# EAGLE design ApolloVoltReg (EAGLE 7.7.0)
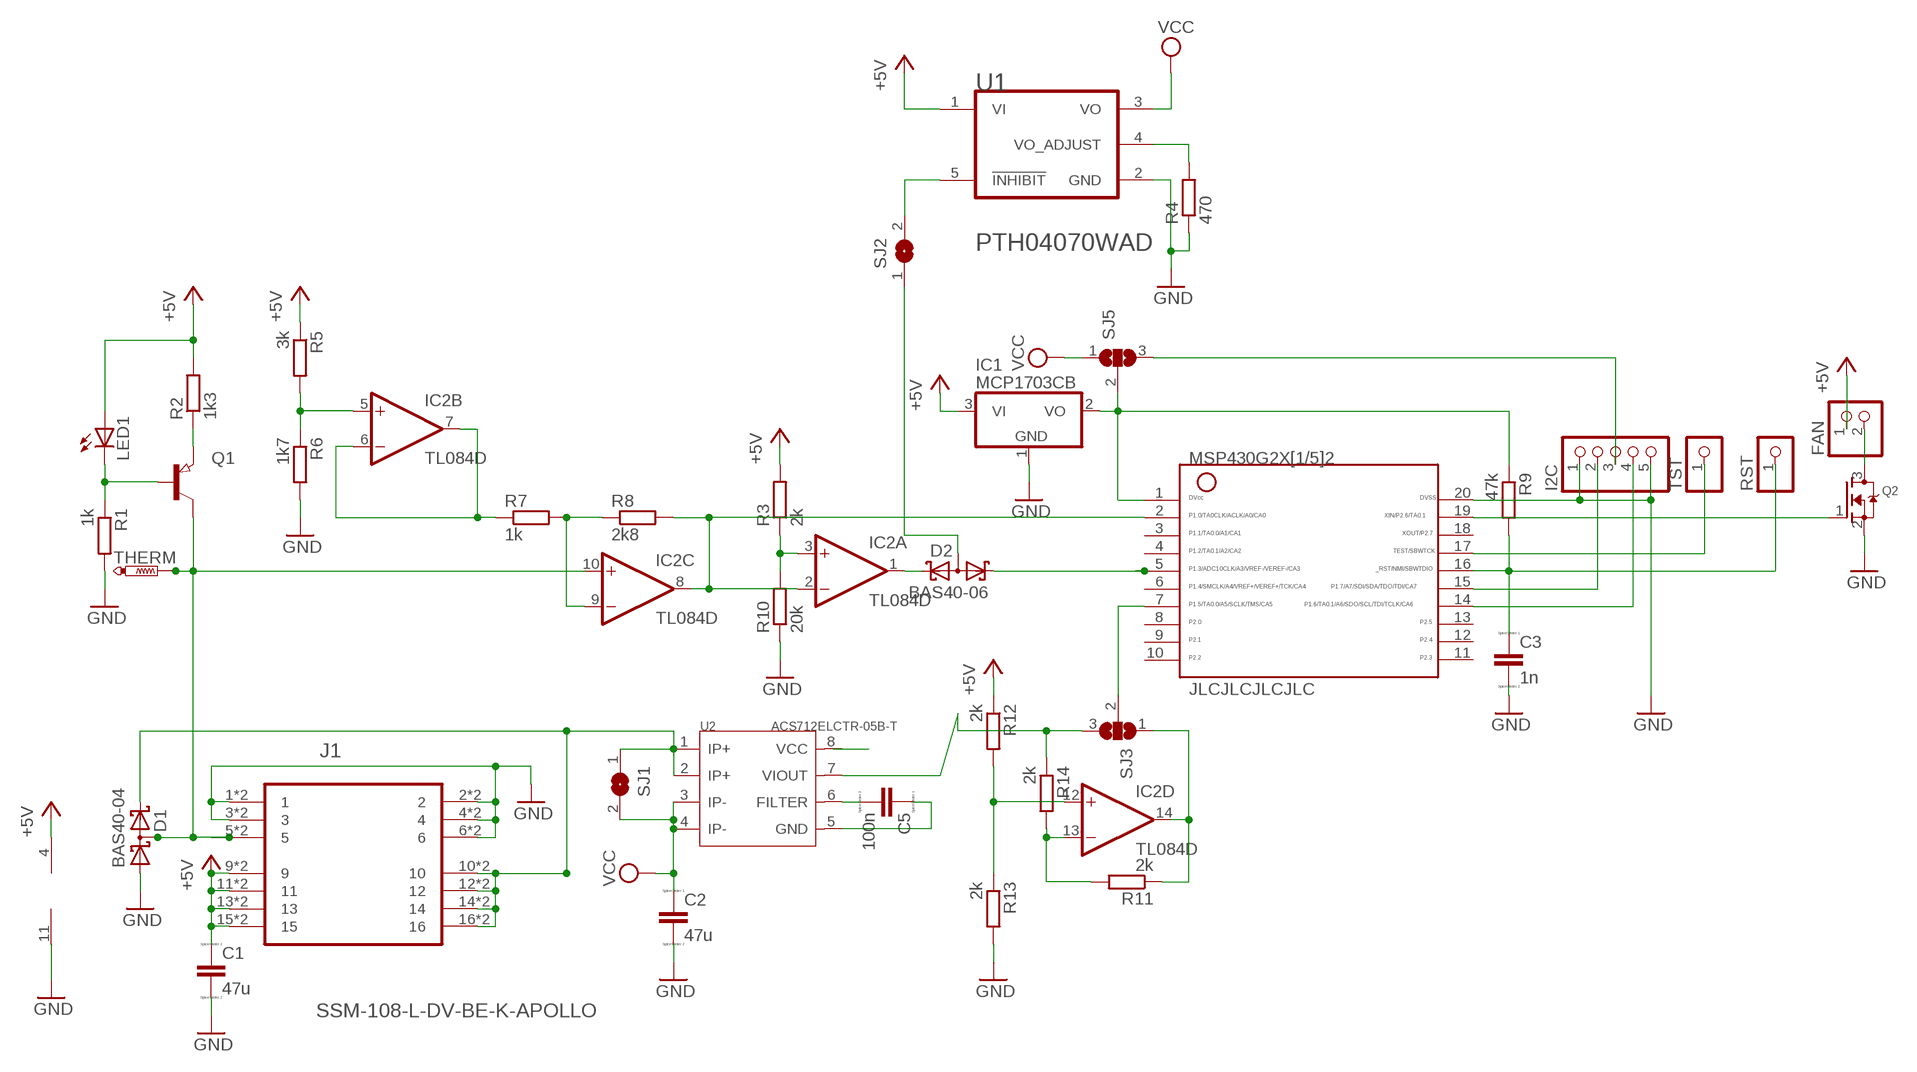
[diagram p0: schematic, sheet 1]

## Parts
C1  47u  CC1210  [C1210]
C2  47u  CC1210  [C1210]
C3  1n  CC0603  [C0603]
C5  100n  CC0603  [C0603]
D1  BAS40-04  [SOT23]
D2  BAS40-06  [SOT23]
FAN  PINHD-1X2  [1X02]
I2C  PINHD-1X5  [1X05]
IC1  MCP1703CB  [SOT23]
IC2  TL084D  [SO14]
J1  SSM-108-L-DV-BE-K-APOLLO  [SAMTEC_SSM-108-L-DV-BE-K-APOLLO]
JLCJLCJLCJLC  G2X[1/5]2---N20  [N20]
LED1  LED3MM  [LED3MM]
Q1  PNP-TRANSISTOR_SOT23  [SOT23]
Q2  MOSFET-NREFLOW  [SOT23]
R1  1k  R-EU_R0805  [R0805]
R2  1k3  R-EU_R0805  [R0805]
R3  2k  R-EU_R0805  [R0805]
R4  470  R-EU_R0805  [R0805]
R5  3k  R-EU_R0805  [R0805]
R6  1k7  R-EU_R0805  [R0805]
R7  1k  R-EU_R0805  [R0805]
R8  2k8  R-EU_R0805  [R0805]
R9  47k  R-EU_R0603  [R0603]
R10  20k  R-EU_R0805  [R0805]
R11  2k  R-EU_R0805  [R0805]
R12  2k  R-EU_R0805  [R0805]
R13  2k  R-EU_R0805  [R0805]
R14  2k  R-EU_R0603  [R0603]
RST  PINHD-1X1CB  [1X01-CLEANBIG]
SJ1  SJW  [SJW]
SJ2  SJ  [SJ]
SJ3  SJ2W  [SJ_2]
SJ5  SJ2W  [SJ_2]
THERM  PTR1B1,27  [B1,27]
TST  PINHD-1X1CB  [1X01-CLEANBIG]
U1  TEXAS_INSTRUMENTS_PTH04070WADTEXAS_INSTRUMENTS_PTH04070WAD_0_0  [TEXAS_INSTRUMENTS_PTH04070WAD_0]
U2  ACS712ELCTR-05B-T  CURRENT-ACS712ELCTR-05B-T(SOIC8-5X4MM)  [SOIC8-1.27-5X4MM]

## Nets
+5V: C1.1 FAN.1 IC1.3(VI) IC2.4(P:V+) J1.9 J1.11 J1.13 J1.15 J1.29 J1.31 J1.33 J1.35 LED1.A R2.2 R3.2 R5.1 R12.1 U1.1(VI) U2.8(VCC)
/INHIBIT: SJ2.2 U1.5(!INHIBIT!)
ACS_OUT: R14.1 SJ3.3 U2.7(VIOUT)
CPU: D1.2(C2) J1.10 J1.12 J1.14 J1.16 J1.30 J1.32 J1.34 J1.36 SJ1.1 U2.1(IP+) U2.2(IP+)
GND: C1.2 C2.2 C3.2 C5.1 D1.1(A1) I2C.1 I2C.5 IC1.1(GND) IC2.11(P:V-) J1.1 J1.2 J1.3 J1.4 J1.6 J1.21 J1.22 J1.23 J1.24 J1.26 JLCJLCJLCJLC.20 Q2.2(S) R1.2 R4.1 R6.2 R10.1 R13.2 U1.2(GND) U2.5(GND)
N$2: LED1.K(C) Q1.1(B) R1.1
N$3: Q1.2(E) R2.1
N$4: IC2.12(D:+IN) R12.2 R13.1
N$5: C5.2 U2.6(FILTER)
N$6: IC2.5(B:+IN) R5.2 R6.1
N$7: IC2.6(B:-IN) IC2.7(B:OUT) R7.1
N$8: IC2.9(C:-IN) R7.2 R8.1
N$9: JLCJLCJLCJLC.19 Q2.1(G)
N$10: JLCJLCJLCJLC.17 TST.1
N$11: IC2.3(A:+IN) R3.1 R10.2
N$12: D2.1(K1) JLCJLCJLCJLC.5
N$13: IC2.13(D:-IN) R11.2 R14.2
N$14: IC2.14(D:OUT) R11.1 SJ3.1
N$15: JLCJLCJLCJLC.7 SJ3.2
N$16: IC1.2(VO) JLCJLCJLCJLC.1 R9.1 SJ5.2
N$17: D2.2(K2) IC2.1(A:OUT)
N$18: D2.3(AA) SJ2.1
N$19: FAN.2 Q2.3(D)
N$21: I2C.3 SJ5.3
RST: C3.1 JLCJLCJLCJLC.16 R9.2 RST.1
SCL: I2C.4 JLCJLCJLCJLC.14
SDA: I2C.2 JLCJLCJLCJLC.15
TEMPSENS: IC2.2(A:-IN) IC2.8(C:OUT) JLCJLCJLCJLC.2 R8.2
THERM1: D1.3(C1A2) IC2.10(C:+IN) J1.5 J1.25 Q1.3(C) THERM.TP
VCC: C2.1 SJ1.2 SJ5.1 U1.3(VO) U2.3(IP-) U2.4(IP-)
VO_ADJ: R4.2 U1.4(VO_ADJUST)
Unconnected: JLCJLCJLCJLC.3 JLCJLCJLCJLC.4 JLCJLCJLCJLC.6 JLCJLCJLCJLC.8 JLCJLCJLCJLC.9 JLCJLCJLCJLC.10 JLCJLCJLCJLC.11 JLCJLCJLCJLC.12 JLCJLCJLCJLC.13 JLCJLCJLCJLC.18

## Library data of the parts
C1-C3 C5 = eagle-ltspice:C: CAPACITOR, European symbol; SPICEMODEL: NONE; SPICEPREFIX: C
D1 = diode:BAS40-04: Silicon Schottky Diodes General-purpose diode for high-speed switching
D2 = diode:BAS40-06: Silicon Schottky Diodes General-purpose diode for high-speed switching
FAN = pinhead:PINHD-1X2: PIN HEADER
I2C = pinhead:PINHD-1X5: PIN HEADER
IC1 = linear:MCP1703: 250 mA, 16V, Low Quiescent Current LDO Regulator Source: http://ww1.microchip.com/downloads/en/DeviceDoc/22049b.pdf
IC2 = linear:TL084: OP AMP
J1 = SAMTEC-FLE-Mxx-Sxx_By_element14_Batch_1:SSM-108-L-DV-BE-K-APOLLO: CONN SOCKET, 2.54MM, SMT, 2X10WAY
JLCJLCJLCJLC = TI_MSP430_v16:G2X[1/5]2---N20: MSP430G2X[1/5]2 MSP430G2x52, MSP430G2x12 PDIP (N) 20 Pin Package http://focus.ti.com/docs/prod/folders/print/msp430g2452.html
LED1 = adafruit:LED: LED OSRAM: - CHIPLED LG R971, LG N971, LY N971, LG Q971, LY Q971, LO R971, LY R971 LH N974, LH R974 LS Q976, LO Q976, LY Q976 LO Q996 - Hyper CHIPLED LW Q18S LB Q993, LB Q99A, LB R99A - SideLED LS A670, LO A670, LY A670, LG A670, LP A670 LB A673, LV A673, LT A673, LW A673 LH A674 LY A675 LS A676, LA A676, LO A676, LY A676, LW A676 LS A679, LY A679, LG A679 - Hyper Micro SIDELED® LS Y876, LA Y876, LO Y876, LY Y876 LT Y87S - SmartLED LW L88C, LW L88S LB L89C, LB L89S, LG L890 LS L89K, LO L89K, LY L89K LS L896, LA L896, LO L896, LY L896 - TOPLED LS T670, LO T670, LY T670, LG T670, LP T670 LSG T670, LSP T670, LSY T670, LOP T670, LYG T670 LG T671, LOG T671, LSG T671 LB T673, LV T673, LT T673, LW T673 LH T674 LS T676, LA T676, LO T676, LY T676, LB T676, LH T676, LSB T676, LW T676 LB T67C, LV T67C, LT T67C, LS T67K, LO T67K, LY T67K, LW E67C LS E67B, LA E67B, LO E67B, LY E67B, LB E67C, LV E67C, LT E67C LW T67C LS T679, LY T679, LG T679 LS T770, LO T770, LY T770, LG T770, LP T770 LB T773, LV T773, LT T773, LW T773 LH T774 LS E675, LA E675, LY E675, LS T675 LS T776, LA T776, LO T776, LY T776, LB T776 LHGB T686 LT T68C, LB T68C - Hyper Mini TOPLED® LB M676 - Mini TOPLED Santana® LG M470 LS M47K, LO M47K, LY M47K Source: http://www.osram.convergy.de/
Q1 = semicon-smd-ipc:PNP-TRANSISTOR_: PNP TRANSISTOR
Q2 = adafruit:MOSFET-N: N-Channel Mosfet 2N7002E - 60V 260mA SOT23 [Digikey: 2N7002ET1GOSTR-ND] - REEL BSH103 - 30V 850mA SOT23 [Digikey: 568-5013-1-ND]
R1-R14 = resistor:R-EU_: RESISTOR, European symbol
RST TST = adafruit:PINHD-1X1: Pin header 1x1 for 0.1" spacing With round pins
SJ1 SJ2 = jumper:SJ: SMD solder JUMPER
SJ3 SJ5 = jumper:SJ2W: SMD solder JUMPER
THERM = testpad:PTR1: TEST PIN
U1 = Texas Instruments - PTH04070WAD:TEXAS_INSTRUMENTS_PTH04070WAD: TI-PTH04070WEVX5; CIIVA_IDS: 1590823; COMPONENT_LINK_1_DESCRIPTION: Manufacturer URL; COMPONENT_LINK_1_URL: http://www.ti.com/; COMPONENT_LINK_3_DESCRIPTION: Package Specification; COMPONENT_LINK_3_URL: http://www.ti.com/litv/pdf/mpds181; COMPONENT_LINK_4_DESCRIPTION: URL Link1; COMPONENT_LINK_4_URL: Samples URL:http://www.ti.com/product/pth04070w#samples; DATASHEET: http://www.ti.com/general/docs/lit/getliterature.tsp?genericPartNumber=PTH04070W&fileType=pdf; DATASHEET_VERSION: SLTS227B; FOOTPRINT_VARIANT_NAME_0: Manufacturer Recommended; IMPORTED: yes; IMPORTED_FROM: vault; IMPORT_TS: 1521841843; IOUT_MAX_A: 3; MF: Texas Instruments; MOUNTING_TECHNOLOGY: Through Hole; MPN: PTH04070WAD; PACKAGE: EVD0005A; PACKAGE_DESCRIPTION: 5-Pin Plastic Special Shape, Body 10.16 x 12.57 mm; PACKAGE_VERSION: 4206288/A; PREFIX: U; REGULATED_OUTPUTS: 1; RELEASE_DATE: 1464587324; ROHS: Yes; SUB_FAMILY: Non-Isolated POL; VAULT_GUID: 164B944F-7FED-4607-B5BF-B9E75A58CE34; VAULT_REVISION: 34EA2767-A9AE-4229-ABAA-C5B8F9910305; VIN_MAX_V: 5.5; VIN_MIN_V: 3; VOUT_MAX_V: 3.6; VOUT_MIN_V: 0.9; VO_ADJUSTABLE: true
U2 = Seeed-OPL-sensor:CURRENT-ACS712ELCTR-05B-T(SOIC8-5X4MM): 314090001; MPN: ACS712ELCTR-05B-T

## Board
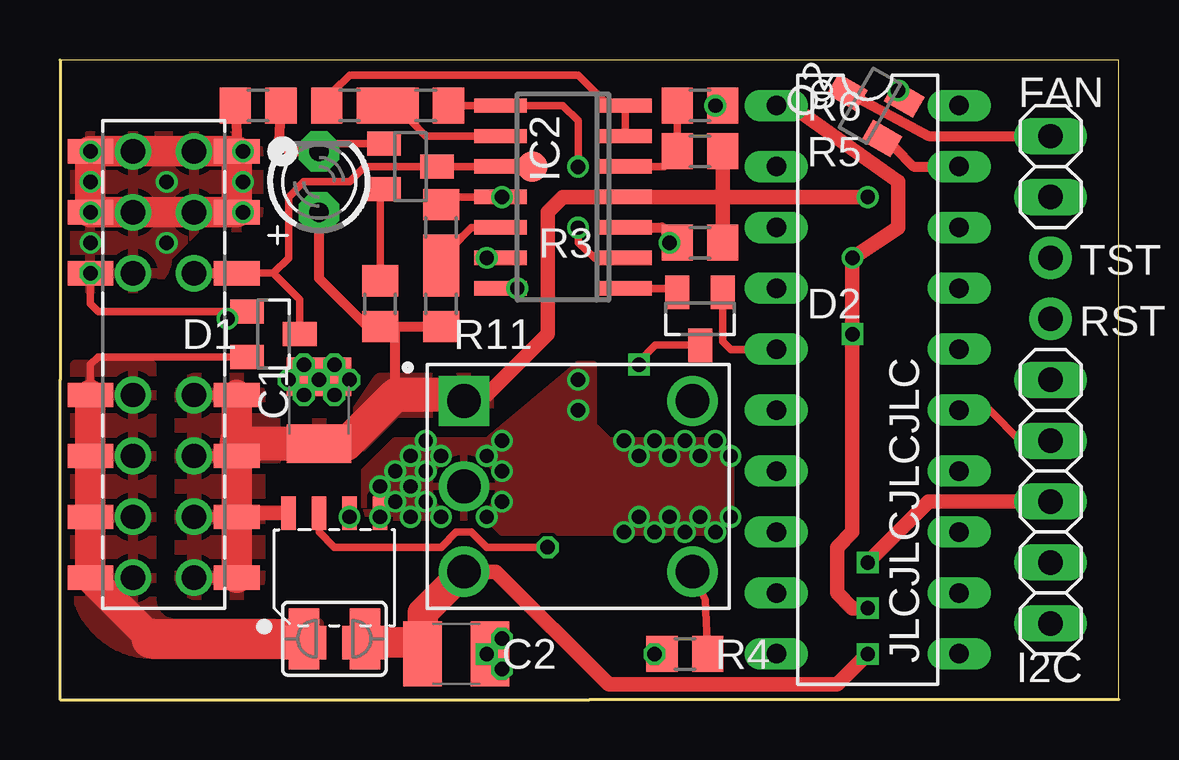
[diagram p1: board, top side]
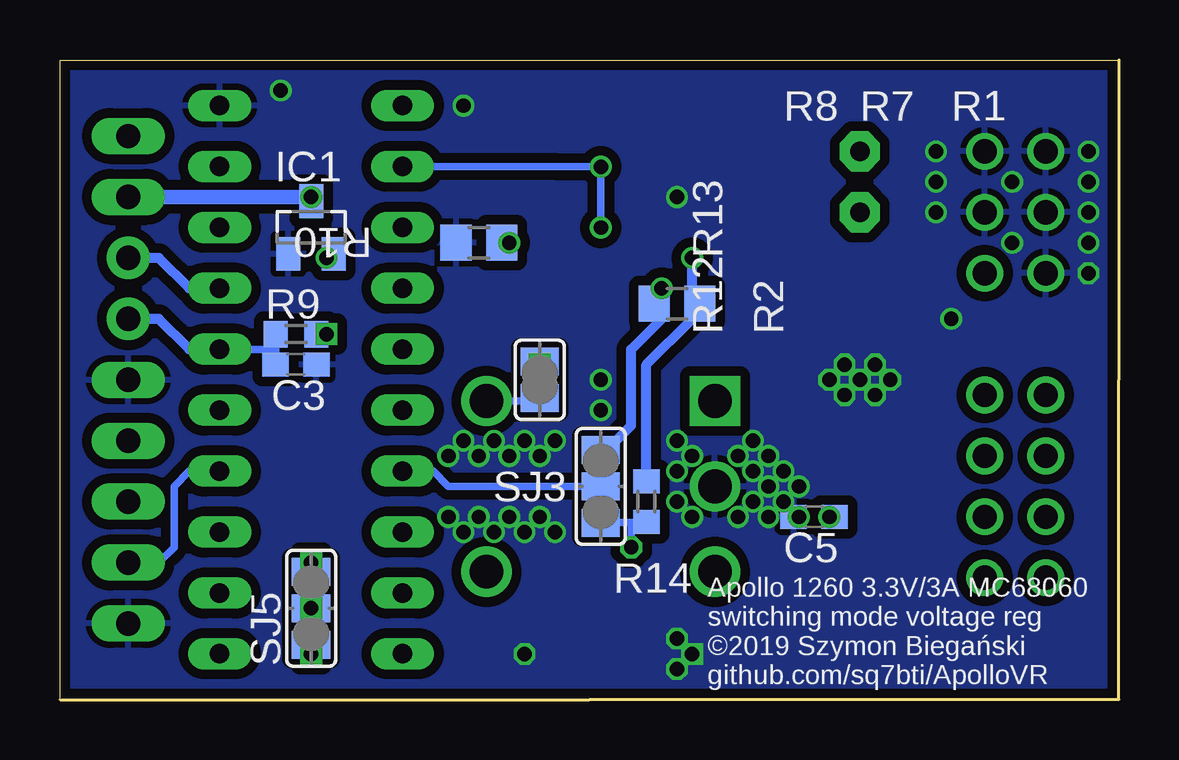
[diagram p2: board, bottom side, seen from below]

Size 44.12 x 26.67 mm. Coordinates in mm from the lower left corner, seen from the top.
Outline: 0,0 44.12,0 44.12,26.66 0,26.66 0,0
Copper layers (1*16): Top 0.035mm / dielectric 1.5mm / Bottom 0.035mm
Design rules "Elecrow_2-layer_eagle_rule": minimum track width 6mil, minimum drill 12mil, track to track 6mil, track to pad 6mil, pad to pad 6mil, via to via 6mil, smd to smd 0mil, copper to edge 10mil, drill to drill 10mil, minimum pad ring 10mil, minimum via ring 6mil, stop-mask expansion 2mil, vias tented up to drill 100mil, thermal gap 10mil

### Footprints (pad centres in the part's own frame; a part is rotated, then mirrored left to right if it is on the bottom)
C1210 = smd 1.6 x 2.7: 1 -1.4,0; 2 1.4,0
C0603 = smd 1.1 x 1: 1 -0.85,0; 2 0.85,0
SOT23 = smd 1 x 1.4: 1 -0.95,-1.1; 2 0.95,-1.1; 3 0,1.1
1X02 = drill 1.016 long: 1 -1.27,0; 2 1.27,0
1X05 = drill 1.016 long: 1 -5.08,0; 2 -2.54,0; 3 0,0; 4 2.54,0; 5 5.08,0
SO14 = smd 0.6 x 2.2: 1 -3.81,-2.6; 2 -2.54,-2.6; 3 -1.27,-2.6; 4 0,-2.6; 5 1.27,-2.6; 6 2.54,-2.6; 7 3.81,-2.6; 8 3.81,2.6; 9 2.54,2.6; 10 1.27,2.6; 11 0,2.6; 12 -1.27,2.6; 13 -2.54,2.6; 14 -3.81,2.6
SAMTEC_SSM-108-L-DV-BE-K-APOLLO = smd 1.016 x 1.905: 1 17.78,-6.096; 2 17.78,0; 3 15.24,-6.096; 4 15.24,0; 5 12.7,-6.096; 6 12.7,0; 9 7.62,-6.096; 10 7.62,0; 11 5.08,-6.096; 12 5.08,0; 13 2.54,-6.096; 14 2.54,0; 15 0,-6.096; 16 0,0 | drill 1.016: 21 17.78,-4.318; 22 17.78,-1.778; 23 15.24,-4.318; 24 15.24,-1.778; 25 12.7,-4.318; 26 12.7,-1.778; 29 7.62,-4.318; 30 7.62,-1.778; 31 5.08,-4.318; 32 5.08,-1.778; 33 2.54,-4.318; 34 2.54,-1.778; 35 0,-4.318; 36 0,-1.778
N20 = drill 0.813 long: 1 -11.435,-3.81; 2 -8.895,-3.81; 3 -6.355,-3.81; 4 -3.815,-3.81; 5 -1.275,-3.81; 6 1.265,-3.81; 7 3.805,-3.81; 8 6.345,-3.81; 9 8.885,-3.81; 10 11.425,-3.81; 11 11.425,3.81; 12 8.885,3.81; 13 6.345,3.81; 14 3.805,3.81; 15 1.265,3.81; 16 -1.275,3.81; 17 -3.815,3.81; 18 -6.355,3.81; 19 -8.895,3.81; 20 -11.435,3.81
LED3MM = drill 0.813 pad 1.676 octagon: A -1.27,0; K 1.27,0
R0805 = smd 1.3 x 1.5: 1 -0.95,0; 2 0.95,0
R0603 = smd 1 x 1.1: 1 -0.85,0; 2 0.85,0
1X01-CLEANBIG = drill 1.016 pad 1.778: 1 0,0
SJW = smd 1.27 x 2.54: 1 -1.27,0; 2 1.27,0
SJ = smd 1.168 x 1.6: 1 -0.762,0; 2 0.762,0
SJ_2 = smd 1.168 x 1.6: 1 -1.524,0; 2 0,0; 3 1.524,0
B1,27 = smd 1.27 x 1.27: TP 0,0
TEXAS_INSTRUMENTS_PTH04070WAD_0 = drill 1.4 pad 1.9 square: 1 -4.76,3.56 | drill 1.4 pad 1.9: 2 -4.76,0; 3 -4.76,-3.56; 4 4.76,-3.56; 5 4.76,3.56
SOIC8-1.27-5X4MM = smd 0.6 x 1.4: 1 -1.905,-2.7; 2 -0.635,-2.7; 3 0.635,-2.7; 4 1.905,-2.7; 5 1.905,2.7; 6 0.635,2.7; 7 -0.635,2.7; 8 -1.905,2.7

### Placement (x,y rotation side)
C1  10.79,12.06 90 top
C2  16.51,1.91 0 top
C3  34.29,13.97 0 bottom
C5  12.7,7.62 0 bottom
D1  8.89,15.24 270 top
D2  26.67,15.88 180 top
FAN  41.27,22.23 90 top
I2C  41.27,8.26 270 top
IC1  33.65,19.68 0 bottom
IC2  20.96,20.95 90 top
J1  1.27,5.08 90 top
JLCJLCJLCJLC  33.65,13.34 270 top
LED1  10.79,21.59 90 top
Q1  14.61,22.23 270 top
Q2  33.76,24.77 60 top
R1  8.26,24.77 180 top
R2  13.34,16.51 270 top
R3  26.67,19.05 0 top
R4  26.04,1.91 0 top
R5  26.67,22.86 180 top
R6  26.67,24.77 0 top
R7  12.07,24.77 0 top
R8  15.24,24.77 0 top
R9  34.29,15.24 180 bottom
R10  26.67,19.05 0 bottom
R11  18.41,16.51 0 bottom
R12  15.88,16.51 90 top
R13  15.88,19.68 90 top
R14  19.68,8.26 90 bottom
RST  41.27,15.88 0 top
SJ1  11.43,2.54 0 top
SJ2  24.13,13.34 270 bottom
SJ3  21.59,8.89 270 bottom
SJ5  33.65,3.81 90 bottom
THERM  19.68,22.23 0 top
TST  41.27,18.41 0 top
U1  21.59,8.89 0 top
U2  11.43,5.08 0 top

### Tracks (layer width: path | path; a pad name or v marks a point on that pad's centre or on a via)
+5V  (via drill 0.6)
  Top 0.406: J1.29 J1.9 | J1.31 J1.11 | J1.33 J1.13 | J1.35 J1.15 | LED1.A 10.79,17.57 12.8,15.56 R2.2 13.97,15.56 | 13.97,15.56 R12.1 | 13.97,12.7 13.97,15.56
  Top 0.61: U2.8 7.62,7.78 | 7.62,7.78 7.37,7.78 | 16.58,12.7 17.78,12.7 20.32,15.24 20.32,20.32 20.96,20.95 IC2.4 27.62,20.95 | J1.13 7.46,7.62 7.62,7.78 | 27.62,20.95 v33.65,20.95 | R3.2 R5.1 27.62,20.95
  Top 1.27: U1.1 16.58,12.7 | J1.15 J1.13 J1.11 7.37,10.79 J1.9
  Top 1.422: 7.37,10.79 7.37,10.66 C1.1 11.94,10.66 13.97,12.7 16.58,12.7
  Bottom 0.305: v33.65,20.95 IC1.3
  Bottom 0.61: v33.65,20.95 FAN.1
  pour Top: 5.71,13.34 7.62,13.34 arc-90 8.26,12.7 8.26,12.06 arc90 8.89,11.43 12.07,11.43 13.34,13.34 17.78,13.34 17.78,12.06 13.97,12.06 12.07,10.16 8.89,10.16 arc90 8.26,9.53 8.26,5.08 arc-90 7.62,4.45 5.71,4.45 arc-90 5.08,5.08 5.08,12.7 arc-90
/INHIBIT
  Bottom 0.305: U1.5 24.25,12.45 SJ2.2
ACS_OUT  (via drill 0.6)
  Top 0.305: U2.7 10.79,6.99 11.43,6.35 15.88,6.35 16.51,6.99 17.14,6.99 17.78,6.35 v20.32,6.35
  Bottom 0.305: R14.1 20.32,7.39 | v20.32,6.35 20.32,7.39 | 20.32,7.39 21.56,7.39 SJ3.3
CPU
  Top 0.305: D1.2 1.59,14.29 1.27,13.97 J1.10
  Top 0.406: U2.1 10.16,2.38 | U2.2 10.16,2.38 | 10.16,2.38 SJ1.1
  Top 1.27: J1.10 J1.16 3.81,2.54
  Top 1.676: 3.81,2.54 SJ1.1
  pour Top: 0.64,13.97 3.81,13.97 3.81,4.17 arc90 4.81,3.17 10.79,3.17 10.79,1.91 3.81,1.91 arc-90 0.64,5.08
GND  (via drill 0.6)
  Top 0.305: v17.78,1.91 C2.2 | R4.1 v24.77,1.91 | v27.3,24.77 R6.2 | IC2.11 15.66,20.95 R13.2 | D1.1 1.59,16.19 1.27,16.51 J1.6
  Top 0.406: v18.41,20.95 IC2.11 | R1.2 7.41,22.9 J1.1 | v34.92,25.4 35.18,25.4 Q2.2
  Top 0.61: v10.79,13.34 C1.2
  Top 1.27: J1.4 v1.27,21.59 J1.2 J1.1 J1.3 J1.4
  other vias: 1.27,22.86 1.27,20.32 7.62,20.32 1.27,19.05 7.62,21.59 13.97,9.53 15.24,9.53 14.61,10.16 15.24,8.26 14.61,8.89 17.78,10.16 15.88,10.16 23.5,10.79 24.77,10.79 24.13,10.16 25.4,10.16 23.5,6.99 24.77,6.99 26.04,6.99 24.13,7.62 1.27,17.78 7.62,22.86 4.45,21.59 4.45,19.05 6.99,15.88 10.16,13.97 11.43,13.97 18.41,2.54 18.41,1.27 13.97,8.26 14.61,7.62 13.34,7.62 13.34,8.89 18.41,9.53 18.41,8.26 18.41,10.79 25.4,7.62 26.67,7.62 27.3,6.99 26.04,10.79 26.67,10.16 27.3,10.79 10.16,12.7 12.07,13.34 9.53,13.34 21.59,12.06 21.59,13.34 27.94,10.16 27.94,7.62 17.78,7.62 15.88,7.62 15.24,10.79 11.43,12.7
  pour Bottom (isolate 0.406): 0,26.67 43.81,26.67 43.81,0 0,0
  pour Top: 1.27,23.5 7.62,23.5 arc-90 8.26,22.86 8.26,20.32 arc-90 7.62,19.68 5.71,19.68 4.45,18.41 arc-90 3.18,17.14 1.27,17.14 arc-90 0.64,17.78 0.64,22.86 arc-90
  pour Top: 13.97,10.79 17.78,10.79 21.59,13.97 22.23,13.97 22.23,11.43 22.86,10.79 27.3,10.79 27.94,10.16 27.94,7.62 27.3,6.99 18.41,6.99 17.78,7.62 12.7,7.62 12.7,9.53
N$2
  Top 0.305: Q1.1 11.11,23.18 LED1.K
  Top 0.406: R1.1 9.11,23.28 9.53,22.86 LED1.K
N$3
  Top 0.305: R2.1 13.34,21.11 Q1.2
N$4
  Top 0.305: R12.2 15.88,17.78 16.3,18.2 R13.1 16.3,18.84 17.14,19.68 IC2.12
N$5  (via drill 0.6)
  Top 0.305: v12.07,7.62 U2.6
  Bottom 0.305: C5.2 v12.07,7.62
N$6
  Top 0.305: R6.1 R5.2 25.18,22.23 IC2.5
N$7
  Top 0.305: IC2.6 IC2.7 22.86,24.77 21.59,26.04 12.07,26.04 11.43,25.4 11.43,25.08 R7.1
N$8
  Top 0.305: R7.2 R8.1 14.61,24.55 14.61,24.13 15.24,23.5 IC2.9
N$9
  Top 0.406: Q2.1 34.75,23.03 35.55,22.23 JLCJLCJLCJLC.19
N$10
  Bottom 0.406: JLCJLCJLCJLC.17 38.74,17.15 40,18.41 TST.1
N$11  (via drill 0.6)
  Top 0.406: IC2.3 25.09,19.68 R10.2
  Top 0.61: v25.4,19.05 R10.2
  Bottom 0.61: R10.2 v25.4,19.05
N$12
  Top 0.305: D2.1 27.62,14.93 27.94,14.61 JLCJLCJLCJLC.5
N$13  (via drill 0.6)
  Top 0.305: v17.78,18.41 IC2.13
  Bottom 0.406: R14.2 19.68,13.97 17.78,15.88 17.78,17.14 | 17.78,17.14 v17.78,18.41 | R11.2 17.78,17.14
N$14  (via drill 0.6)
  Top 0.305: 17.78,17.14 v19.05,17.14
  Top 0.61: v19.05,17.14 IC2.14
  Bottom 0.406: SJ3.1 21.34,10.41 20.32,11.43 20.32,14.61 19.05,15.88 v19.05,17.14
  Bottom 0.61: v19.05,17.14 R11.1
N$15
  Bottom 0.305: SJ3.2 27.94,8.89 28.57,9.53 JLCJLCJLCJLC.7
N$16  (via drill 0.6)
  Top 0.61: JLCJLCJLCJLC.1 30.48,24.77 34.92,21.59 34.92,19.68 v33.02,18.41 v33.02,15.24 33.02,6.99 32.38,6.35 32.38,4.45 33.02,3.81 SJ5.2
  Bottom 0.61: IC1.2 32.85,18.59 v33.02,18.41 | R9.1 v33.02,15.24
  other vias: 33.65,3.81
N$17
  Top 0.305: IC2.1 25.55,17.14 D2.2
N$18  (via drill 0.6)
  Top 0.305: D2.3 24.81,14.78 SJ2.1 v24.13,13.97
  Bottom 0.305: SJ2.1 v24.13,13.97
N$19
  Top 0.406: Q2.3 36.2,23.5 FAN.2
N$21  (via drill 0.6)
  Top 0.61: I2C.3 36.2,8.26 v33.65,5.71
  Bottom 0.61: SJ5.3 v33.65,5.71
RST
  Bottom 0.305: C3.1 35.14,14.61 | 35.14,14.61 R9.2 | JLCJLCJLCJLC.16 35.14,14.61
  Bottom 0.406: JLCJLCJLCJLC.16 38.74,14.61 40,15.88 RST.1
SCL
  Bottom 0.305: JLCJLCJLCJLC.14 38.73,9.53 39.37,8.89 39.37,6.35 40,5.71 I2C.4
SDA
  Top 0.305: JLCJLCJLCJLC.15 38.73,12.07 40,10.79 I2C.2
TEMPSENS  (via drill 0.6)
  Top 0.305: R8.2 IC2.8 20.96,24.77 21.59,24.14 v21.59,22.22 | IC2.2 22.28,18.41 21.59,19.05 v21.59,19.68
  Bottom 0.305: JLCJLCJLCJLC.2 24.13,22.23 23.48,22.23 21.57,22.22 | 21.57,22.22 21.59,21.59 v21.59,19.68 | 21.57,22.22 v21.59,22.22
THERM1
  Top 0.305: J1.5 8.89,17.78 | 8.89,17.78 9.53,18.41 9.53,20.95 10.16,21.59 12.07,21.59 12.7,22.23 Q1.3 IC2.10 | D1.3 9.99,16.68 8.89,17.78
  Top 0.406: J1.25 J1.5 | THERM.TP IC2.10
VCC  (via drill 0.6)
  Top 0.406: U2.3 12.7,2.38 | U2.4 12.7,2.38 | 12.7,2.38 SJ1.2
  Top 0.61: U1.3 18.16,5.33 22.86,0.64 32.38,0.64 v33.65,1.91
  Top 1.27: U1.3 15.11,3.61 C2.1 14.63,2.38 U2.4
  Bottom 0.61: SJ5.1 v33.65,1.91
VO_ADJ
  Top 0.305: R4.2 26.89,4.16 U1.4

### Text on the board
bNames: Apollo 1260 3.3V/3A MC68060 / switching mode voltage reg / ©2019 Szymon Biegański / github.com/sq7bti/ApolloVR